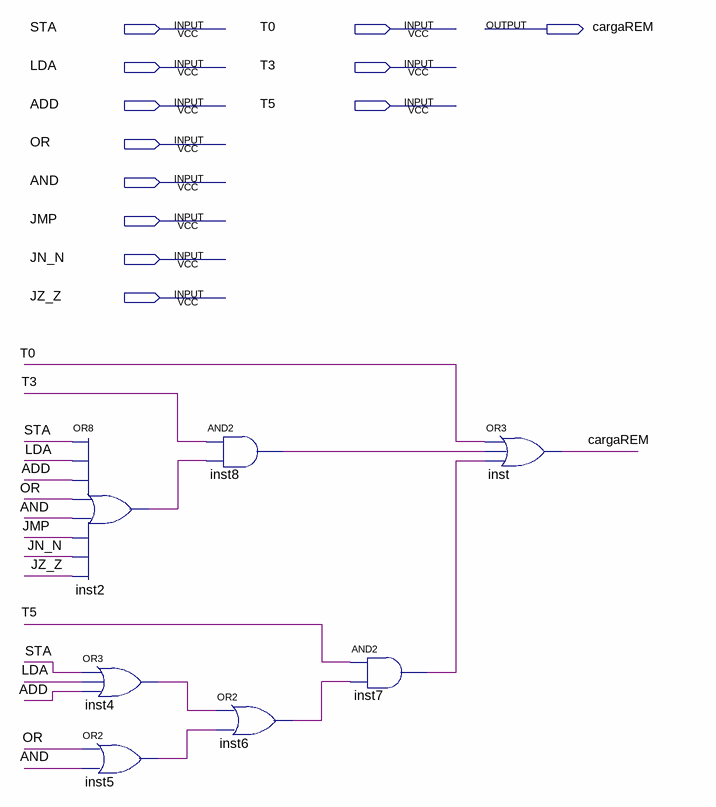
[diagram p0: schematic sheet]
// Quartus schematic cargaREM.bdf as structural Verilog: 7 symbols, 12 pins
module cargaREM (
  input  STA,
  input  T0,
  input  LDA,
  input  T3,
  input  ADD,
  input  T5,
  input  OR,
  input  AND,
  input  JMP,
  input  JN_N,
  input  JZ_Z,
  output cargaREM
);

  wire inst2_out, inst4_out, inst5_out, inst6_out, inst7_out, inst8_out;

  or inst2 (inst2_out, STA, LDA, ADD, OR, AND, JMP, JN_N, JZ_Z);
  or inst4 (inst4_out, STA, LDA, ADD);
  or inst5 (inst5_out, OR, AND);
  and inst8 (inst8_out, T3, inst2_out);
  or inst6 (inst6_out, inst4_out, inst5_out);
  and inst7 (inst7_out, T5, inst6_out);
  or inst (cargaREM, T0, inst8_out, inst7_out);
endmodule
